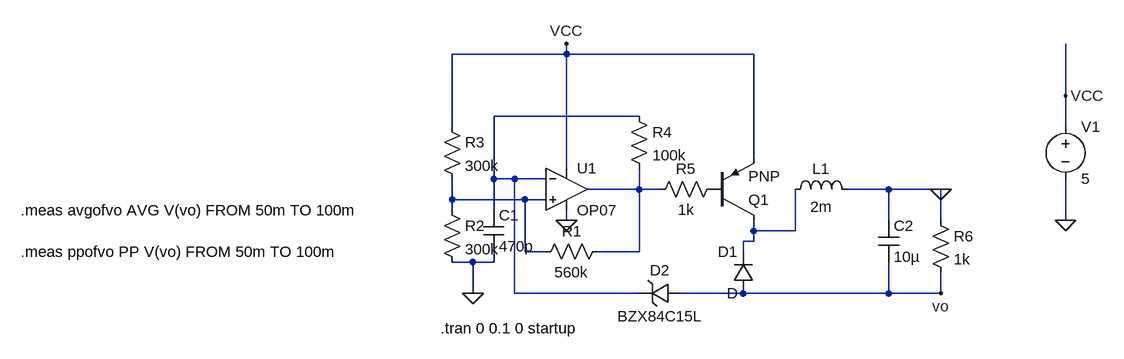
[diagram p0: schematic 1_15.asc]
1_15.asc, the LTspice schematic file:
Version 4
SHEET 1 1032 680
WIRE 208 -48 208 -64
WIRE 208 -48 32 -48
WIRE 496 -48 208 -48
WIRE 976 16 976 -64
WIRE 320 48 96 48
WIRE 32 64 32 -48
WIRE 976 64 976 16
WIRE 496 112 496 -48
WIRE 208 128 208 -48
WIRE 96 144 96 48
WIRE 128 144 96 144
WIRE 176 144 128 144
WIRE 320 160 320 128
WIRE 320 160 240 160
WIRE 352 160 320 160
WIRE 704 160 640 160
WIRE 784 160 704 160
WIRE 32 176 32 144
WIRE 144 176 32 176
WIRE 176 176 144 176
WIRE 32 192 32 176
WIRE 96 192 96 144
WIRE 208 208 208 192
WIRE 704 208 704 160
WIRE 784 208 784 160
WIRE 976 208 976 144
WIRE 496 224 496 208
WIRE 560 224 560 160
WIRE 560 224 496 224
WIRE 496 240 496 224
WIRE 496 240 480 240
WIRE 144 256 144 176
WIRE 176 256 144 256
WIRE 320 256 320 160
WIRE 320 256 256 256
WIRE 480 256 480 240
WIRE 64 272 32 272
WIRE 96 272 96 256
WIRE 96 272 64 272
WIRE 64 320 64 272
WIRE 128 320 128 144
WIRE 320 320 128 320
WIRE 480 320 384 320
WIRE 704 320 704 272
WIRE 704 320 480 320
WIRE 784 320 784 288
WIRE 784 320 704 320
FLAG 208 -64 VCC
FLAG 64 320 0
FLAG 976 208 0
FLAG 976 16 VCC
FLAG 208 208 0
FLAG 784 160 0
FLAG 784 320 vo
SYMBOL OpAmps\\OP07 208 96 R0
SYMATTR InstName U1
SYMBOL res 272 240 R90
WINDOW 0 0 56 VBottom 2
WINDOW 3 32 56 VTop 2
SYMATTR InstName R1
SYMATTR Value 560k
SYMBOL cap 80 192 R0
SYMATTR InstName C1
SYMATTR Value 470p
SYMBOL res 16 176 R0
SYMATTR InstName R2
SYMATTR Value 300k
SYMBOL res 16 48 R0
SYMATTR InstName R3
SYMATTR Value 300k
SYMBOL res 304 32 R0
SYMATTR InstName R4
SYMATTR Value 100k
SYMBOL res 448 144 R90
WINDOW 0 0 56 VBottom 2
WINDOW 3 32 56 VTop 2
SYMATTR InstName R5
SYMATTR Value 1k
SYMBOL ind 544 176 R270
WINDOW 0 32 56 VTop 2
WINDOW 3 5 56 VBottom 2
SYMATTR InstName L1
SYMATTR Value 2m
SYMBOL cap 688 208 R0
SYMATTR InstName C2
SYMATTR Value 10µ
SYMBOL res 768 192 R0
SYMATTR InstName R6
SYMATTR Value 1k
SYMBOL diode 496 320 R180
WINDOW 0 24 64 Left 2
WINDOW 3 24 0 Left 2
SYMATTR InstName D1
SYMBOL pnp 432 208 M180
SYMATTR InstName Q1
SYMBOL zener 384 304 R90
WINDOW 0 -4 32 VBottom 2
WINDOW 3 36 32 VTop 2
SYMATTR InstName D2
SYMATTR Value BZX84C15L
SYMBOL voltage 976 48 R0
WINDOW 123 0 0 Left 0
WINDOW 39 0 0 Left 0
SYMATTR InstName V1
SYMATTR Value 5
TEXT 14 374 Left 2 !.tran 0 0.1 0 startup
TEXT -632 192 Left 2 !.meas avgofvo AVG V(vo) FROM 50m TO 100m
TEXT -632 256 Left 2 !.meas ppofvo PP V(vo) FROM 50m TO 100m

The netlist it stands for:
* 1_15.asc
XU1 N003 N001 VCC 0 N002 LT1001  ; OP07, pins In+ In- V+ V- OUT
R1 N002 N003 560k
C1 N001 0 470p
R2 N003 0 300k
R3 VCC N003 300k
R4 N001 N002 100k
R5 P001 N002 1k
L1 N004 0 2m
C2 0 vo 10µ
R6 0 vo 1k
D1 vo N004 D
Q1 N004 P001 VCC 0 PNP
D2 vo N001 BZX84C15L
V1 VCC 0 5
.model D D
.lib standard.dio
.model NPN NPN
.model PNP PNP
.lib standard.bjt
.tran 0 0.1 0 startup
.meas avgofvo AVG V(vo) FROM 50m TO 100m
.meas ppofvo PP V(vo) FROM 50m TO 100m
.lib LTC.lib
.backanno
.end